# EAGLE design PowerSupply (EAGLE 9.3.2)
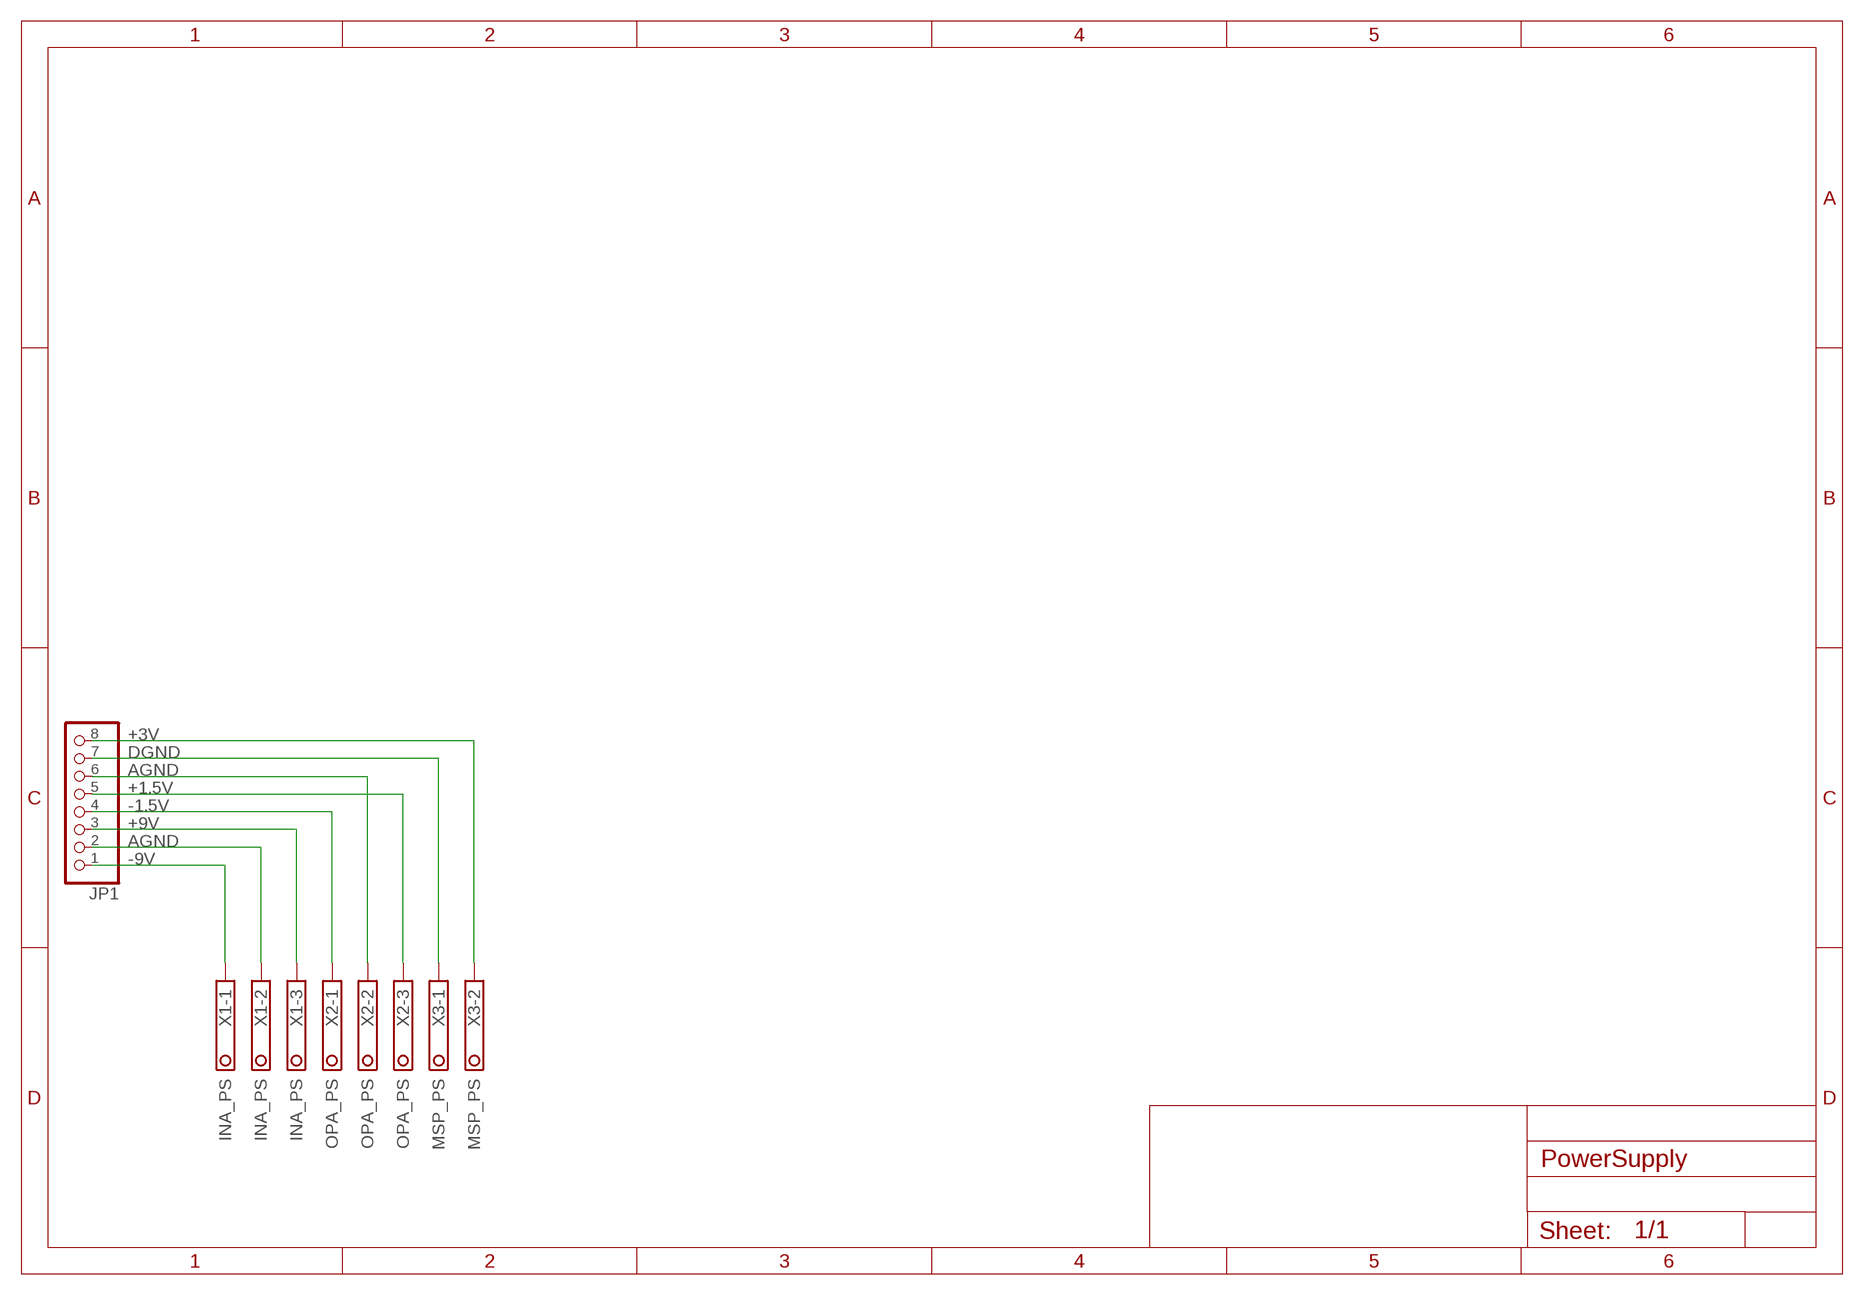
[diagram p0: schematic, sheet 1]

## Parts
JP1  PINHD-1X8  [1X08]
X1  INA_PS  1751251  [1751251]
X2  OPA_PS  1751251  [1751251]
X3  MSP_PS  1751248  [1751248]

## Nets
+1.5V: JP1.5 X2.3
+3V: JP1.8 X3.2
+9V: JP1.3 X1.3
-1.5V: JP1.4 X2.1
-9V: JP1.1 X1.1
AGND: JP1.2 JP1.6 X1.2 X2.2
DGND: JP1.7 X3.1

## Library data of the parts
JP1 = pinhead:PINHD-1X8: PIN HEADER
X1 X2 = Schraubklemme_3polig:1751251: MKDS 1/ 3-3,5 Printklemme Nennstrom: 10 A Bemessungsspannung: 160 V Raster: 3,5 mm Polzahl: 3 Montageart: Löten Anschlussart: Schraubanschluss Anschlussrichtung vom Leiter zur Platine: 0° Source: http://eshop.phoenixcontact.com .. 1751251.pdf; AVAILABILITY: Unavailable; DESCRIPTION: Conn; Term Blk; Screw; 3: 3.5 mm; 26-16 AWG; 10 A; 160 V; Solder; 2.5 kV; PA; MF: Phoenix Contact; MP: 1751251; PACKAGE: None; PRICE: None
X3 = Schraubklemme_2polig:1751248: MKDS 1/ 2-3,5 Printklemme Nennstrom: 10 A Bemessungsspannung: 160 V Raster: 3,5 mm Polzahl: 2 Montageart: Löten Anschlussart: Schraubanschluss Anschlussrichtung vom Leiter zur Platine: 0° Source: http://eshop.phoenixcontact.com .. 1751248.pdf; AVAILABILITY: Unavailable; DESCRIPTION: Conn; Term Blk; Screw; 2: 3.5 mm; 26-16 AWG; 10 A; 160 V; Solder; 2.5 kV; PA; MF: Phoenix Contact; MP: 1751248; PACKAGE: None; PRICE: None

## Board
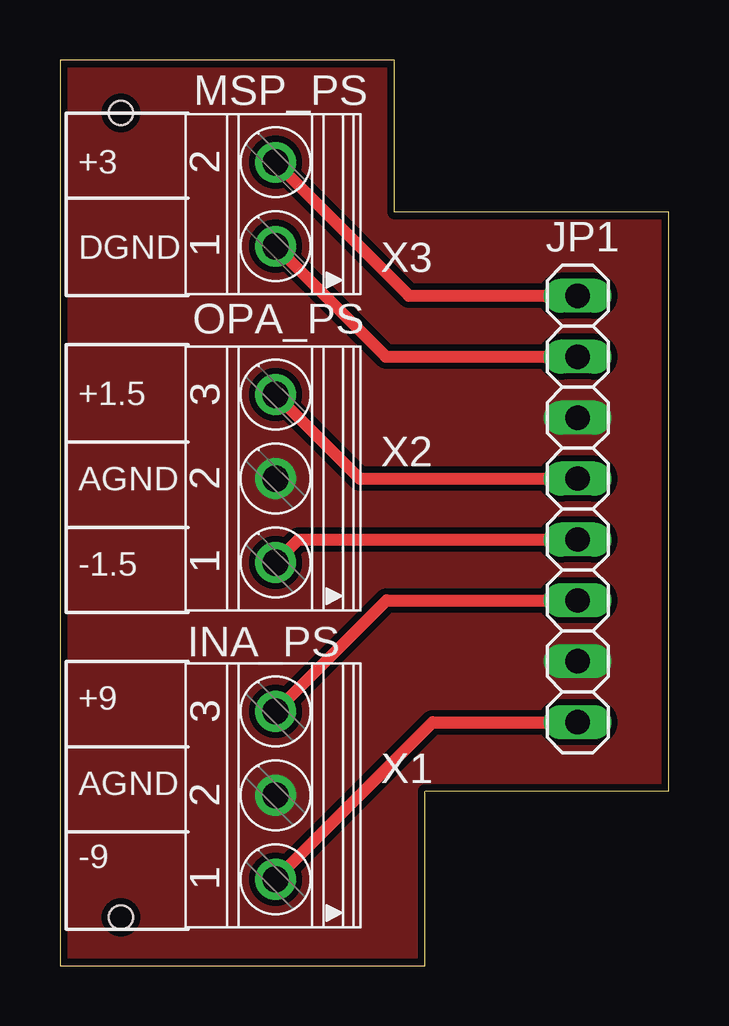
[diagram p1: board, top side]
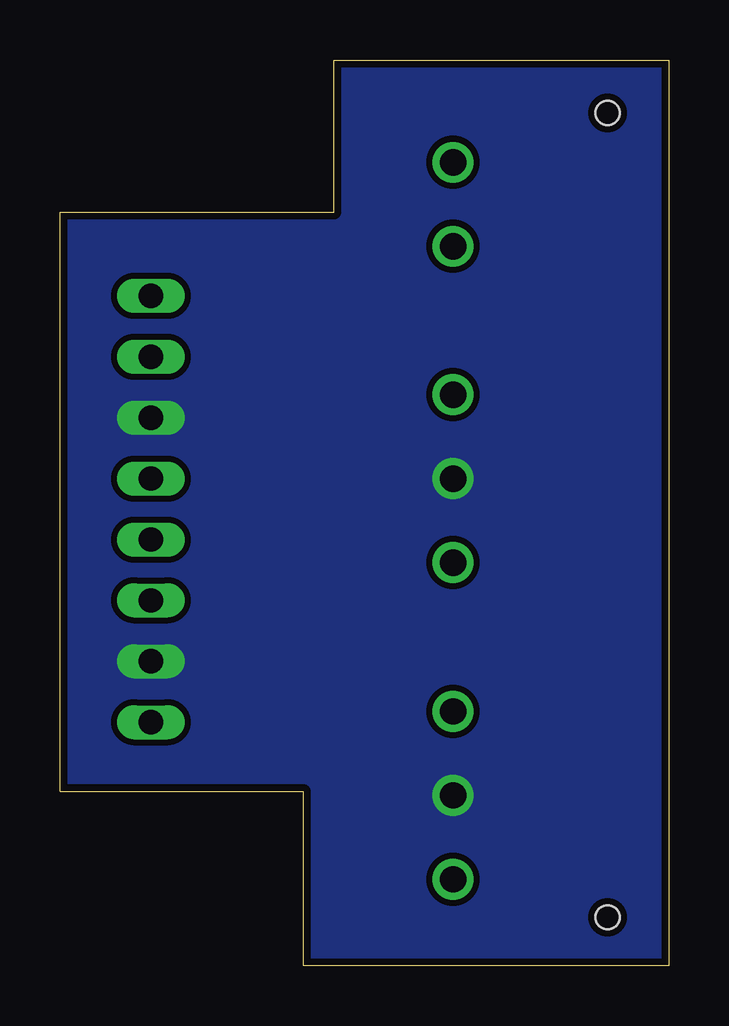
[diagram p2: board, bottom side, seen from below]

Size 25.38 x 37.77 mm. Coordinates in mm from the lower left corner, seen from the top.
Outline: 13.95,31.42 13.95,37.77 0,37.77 0,0 15.22,0 15.22,7.29
Outline: 15.24,7.29 25.38,7.29 25.38,31.42 13.95,31.42
Copper layers (1*16): Top 0.035mm / dielectric 1.5mm / Bottom 0.035mm
Design rules "PCB-POOL Standard": minimum track width 0.15mm, minimum drill 0.3mm, track to track 0.15mm, track to pad 0.15mm, pad to pad 0.15mm, via to via 0.15mm, smd to smd 0.15mm, copper to edge 0.3mm, drill to drill 0.2mm, minimum pad ring 0.2mm, minimum via ring 0.15mm, stop-mask expansion 0.03mm, vias tented up to drill 0mil, thermal gap 0.2mm
Holes 1 mm at 2.54,35.56 2.54,2.03

### Footprints (pad centres in the part's own frame; a part is rotated, then mirrored left to right if it is on the bottom)
1X08 = drill 1.016 long: 1 -8.89,0; 2 -6.35,0; 3 -3.81,0; 4 -1.27,0; 5 1.27,0; 6 3.81,0; 7 6.35,0; 8 8.89,0
1751251 = drill 1.1 pad 1.7: 1 -3.5,-0.1; 2 0,-0.1; 3 3.5,-0.1
1751248 = drill 1.1 pad 1.7: 1 -1.75,-0.1; 2 1.75,-0.1

### Placement (x,y rotation side)
JP1  21.59,19.05 90 top
X1  8.89,7.11 90 top
X2  8.89,20.32 90 top
X3  8.89,31.75 90 top

### Tracks (layer width: path | path; a pad name or v marks a point on that pad's centre or on a via)
+1.5V
  Top 0.508: X2.3 12.49,20.32 JP1.5
+3V
  Top 0.508: X3.2 14.55,27.94 JP1.8
+9V
  Top 0.508: X1.3 13.62,15.24 JP1.3
-1.5V
  Top 0.508: X2.1 9.95,17.78 JP1.4
-9V
  Top 0.508: X1.1 15.54,10.16 JP1.1
AGND
  pour Top (isolate 0.254, no thermals): 0,38.1 0,0 15.24,0 15.24,7.62 25.4,7.62 25.4,31.75 13.97,31.75 13.97,38.1
  pour Bottom (isolate 0.254, no thermals): 0,39.37 13.97,39.37 13.97,31.75 25.4,31.75 25.4,7.62 15.24,7.62 15.24,0 0,0
DGND
  Top 0.508: X3.1 13.59,25.4 JP1.7

### Text on the board
tPlace: +3 | DGND | +1.5 | AGND | -1.5 | +9 | AGND | -9